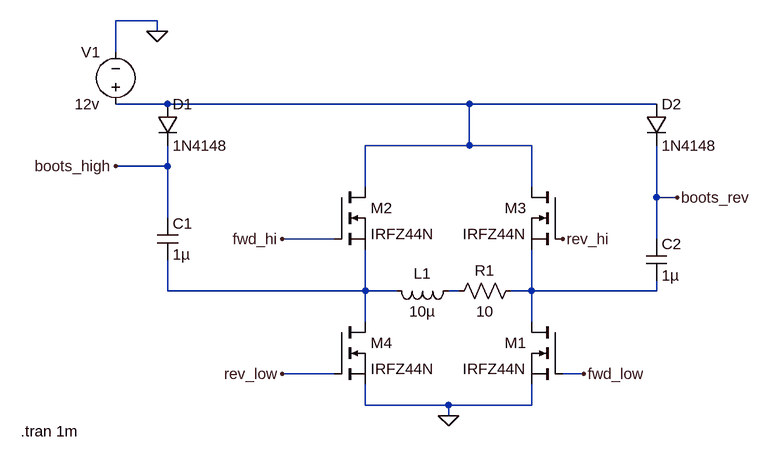
[diagram p0: schematic Draft3.asc]
Draft3.asc, the LTspice schematic file:
Version 4
SHEET 1 1260 680
WIRE -256 -240 -320 -240
WIRE -256 -224 -256 -240
WIRE -320 -192 -320 -240
WIRE -240 -112 -320 -112
WIRE 224 -112 -240 -112
WIRE 512 -112 224 -112
WIRE 224 -48 224 -112
WIRE 224 -48 64 -48
WIRE 320 -48 224 -48
WIRE -240 -16 -240 -48
WIRE -240 -16 -320 -16
WIRE 64 16 64 -48
WIRE 320 16 320 -48
WIRE 512 32 512 -48
WIRE 544 32 512 32
WIRE -240 64 -240 -16
WIRE 16 96 -64 96
WIRE 512 96 512 32
WIRE -240 176 -240 128
WIRE 64 176 64 112
WIRE 64 176 -240 176
WIRE 112 176 64 176
WIRE 208 176 192 176
WIRE 320 176 320 112
WIRE 320 176 288 176
WIRE 512 176 512 160
WIRE 512 176 320 176
WIRE 64 224 64 176
WIRE 320 224 320 176
WIRE 16 304 -64 304
WIRE 400 304 368 304
WIRE 64 352 64 320
WIRE 192 352 64 352
WIRE 320 352 320 320
WIRE 320 352 192 352
WIRE 192 368 192 352
FLAG 192 368 0
FLAG 368 96 rev_hi
FLAG 544 32 boots_rev
FLAG 400 304 fwd_low
FLAG -320 -16 boots_high
FLAG -256 -224 0
FLAG -64 96 fwd_hi
FLAG -64 304 rev_low
SYMBOL nmos 368 16 M0
SYMATTR InstName M3
SYMATTR Value IRFZ44N
SYMBOL cap -256 64 R0
SYMATTR InstName C1
SYMATTR Value 1µ
SYMBOL diode -256 -112 R0
SYMATTR InstName D1
SYMATTR Value 1N4148
SYMBOL diode 496 -112 R0
SYMATTR InstName D2
SYMATTR Value 1N4148
SYMBOL cap 496 96 R0
SYMATTR InstName C2
SYMATTR Value 1µ
SYMBOL ind 208 160 R90
WINDOW 0 5 56 VBottom 2
WINDOW 3 32 56 VTop 2
SYMATTR InstName L1
SYMATTR Value 10µ
SYMBOL res 304 160 R90
WINDOW 0 0 56 VBottom 2
WINDOW 3 32 56 VTop 2
SYMATTR InstName R1
SYMATTR Value 10
SYMBOL nmos 368 224 M0
SYMATTR InstName M1
SYMATTR Value IRFZ44N
SYMBOL nmos 16 16 R0
SYMATTR InstName M2
SYMATTR Value IRFZ44N
SYMBOL nmos 16 224 R0
SYMATTR InstName M4
SYMATTR Value IRFZ44N
SYMBOL voltage -320 -96 R180
WINDOW 0 24 96 Left 2
WINDOW 3 24 16 Left 2
WINDOW 123 0 0 Left 0
WINDOW 39 0 0 Left 0
SYMATTR InstName V1
SYMATTR Value 12v
TEXT -466 392 Left 2 !.tran 1m

The netlist it stands for:
* Draft3.asc
M3 N001 rev_hi N004 N004 IRFZ44N
C1 boots_high N002 1µ
D1 N001 boots_high 1N4148
D2 N001 boots_rev 1N4148
C2 boots_rev N004 1µ
L1 N003 N002 10µ
R1 N004 N003 10
M1 N004 fwd_low 0 0 IRFZ44N
M2 N001 fwd_hi N002 N002 IRFZ44N
M4 N002 rev_low 0 0 IRFZ44N
V1 N001 0 12v
.model D D
.lib standard.dio
.model NMOS NMOS
.model PMOS PMOS
.lib standard.mos
.tran 1m
.backanno
.end